# EAGLE design io (EAGLE 7.7.0)
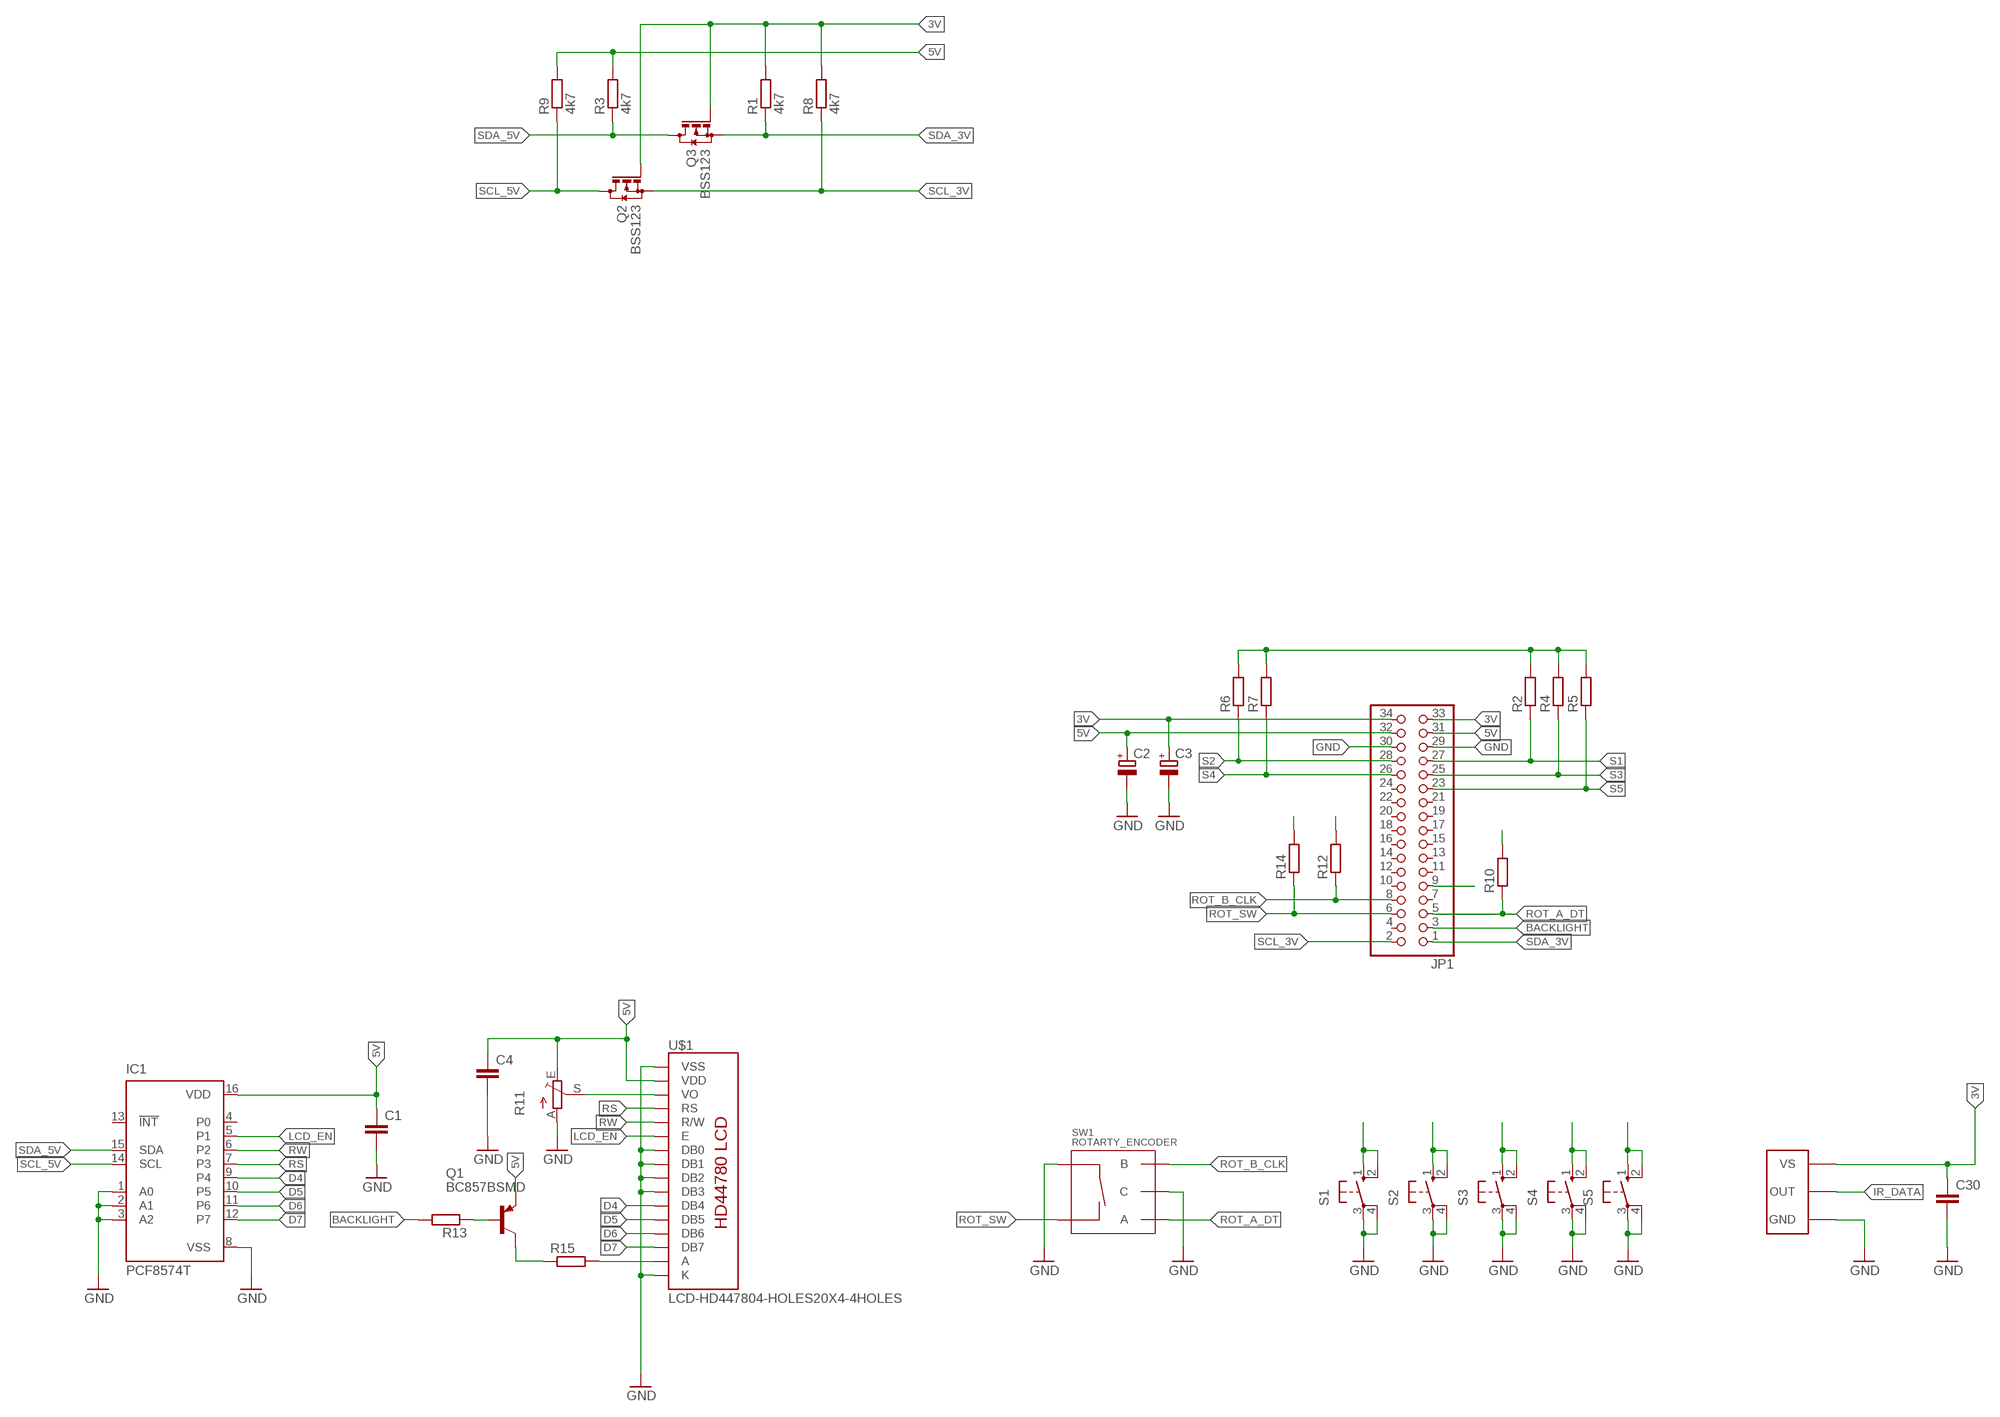
[diagram p0: schematic, sheet 1]

## Parts
C1  C-EUC0603  [C0603]
C2  CPOL-EUSMCD  [SMC_D]
C3  CPOL-EUSMCB  [SMC_B]
C4  C-EUC1206  [C1206]
C30  C-EUC1206  [C1206]
IC1  PCF8574T  [SO16W]
JP1  PINHD-2X17_2.54-SMD  [2X17SMD]
Q1  BC857BSMD  [SOT23-BEC]
Q2  BSS123  [SOT23]
Q3  BSS123  [SOT23]
R1  4k7  R-EU_R0603  [R0603]
R2  R-EU_0204/7  [0204/7]
R3  4k7  R-EU_R0603  [R0603]
R4  R-EU_0204/7  [0204/7]
R5  R-EU_0204/7  [0204/7]
R6  R-EU_0204/7  [0204/7]
R7  R-EU_0204/7  [0204/7]
R8  4k7  R-EU_R0603  [R0603]
R9  4k7  R-EU_R0603  [R0603]
R10  R-EU_0204/7  [0204/7]
R11  TRIM_EU-B25U  [B25U]
R12  R-EU_0204/7  [0204/7]
R13  R-EU_0204/7  [0204/7]
R14  R-EU_0204/7  [0204/7]
R15  R-EU_R0603  [R0603]
S1  40-XX  [B3F-40XX]
S2  40-XX  [B3F-40XX]
S3  40-XX  [B3F-40XX]
S4  40-XX  [B3F-40XX]
S5  40-XX  [B3F-40XX]
SW1  ROTARTY_ENCODER  [ROTARY_ENC_PLAIN]
U$1  LCD-HD447804-HOLES20X4-4HOLES  [LCD-20X4-4HOLES]
U$5  TSOP312XVERTICAL  [TSOP312X_VERT]

## Nets
3V: C3.+ C30.1 JP1.33 JP1.34 Q2.1(G) Q3.1(G) R1.2 R2.2 R4.2 R5.2 R6.2 R7.2 R8.2 R10.2 R12.2 R14.2 U$5.2(VS)
5V: C1.1 C2.+ C4.1 IC1.16(VDD) JP1.31 JP1.32 Q1.E R3.2 R9.2 R11.E U$1.P$2(VDD)
BACKLIGHT: JP1.3 R13.2
D4: IC1.9(P4) U$1.P$11(DB4)
D5: IC1.10(P5) U$1.P$12(DB5)
D6: IC1.11(P6) U$1.P$13(DB6)
D7: IC1.12(P7) U$1.P$14(DB7)
GND: C1.2 C2.- C3.- C4.2 C30.2 IC1.1(A0) IC1.2(A1) IC1.3(A2) IC1.8(VSS) JP1.29 JP1.30 R11.A S1.3(P) S1.4(P1) S2.3(P) S2.4(P1) S3.3(P) S3.4(P1) S4.3(P) S4.4(P1) S5.3(P) S5.4(P1) SW1.C SW1.SW+ U$1.P$1(VSS) U$1.P$7(DB0) U$1.P$8(DB1) U$1.P$9(DB2) U$1.P$10(DB3) U$1.P$16(K) U$5.1(GND)
IR_DATA: JP1.9 U$5.3(OUT)
LCD_EN: IC1.5(P1) U$1.P$6(E)
N$1: Q1.C R15.1
N$3: R15.2 U$1.P$15(A)
N$6: Q1.B R13.1
N$14: R11.S U$1.P$3(VO)
ROT_A_DT: JP1.5 R10.1 SW1.A
ROT_B_CLK: JP1.8 R12.1 SW1.B
ROT_SW: JP1.6 R14.1 SW1.SW-
RS: IC1.7(P3) U$1.P$4(RS)
RW: IC1.6(P2) U$1.P$5(R/W)
S1: JP1.27 R2.1 S1.1(S) S1.2(S1)
S2: JP1.28 R6.1 S2.1(S) S2.2(S1)
S3: JP1.25 R4.1 S3.1(S) S3.2(S1)
S4: JP1.26 R7.1 S4.1(S) S4.2(S1)
S5: JP1.23 R5.1 S5.1(S) S5.2(S1)
SCL_3V: JP1.2 Q2.2(S) R8.1
SCL_5V: IC1.14(SCL) Q2.3(D) R9.1
SDA_3V: JP1.1 Q3.2(S) R1.1
SDA_5V: IC1.15(SDA) Q3.3(D) R3.1
Unconnected: IC1.4(P0) IC1.13(!INT) JP1.4 JP1.7 JP1.10 JP1.11 JP1.12 JP1.13 JP1.14 JP1.15 JP1.16 JP1.17 JP1.18 JP1.19 JP1.20 JP1.21 JP1.22 JP1.24

## Library data of the parts
C1 C4 C30 = rcl:C-EU: CAPACITOR, European symbol
C2 C3 = rcl:CPOL-EU: POLARIZED CAPACITOR, European symbol
IC1 = micro-philips:PCF8574: I2C-Bus Remote 8-bit I/O expander http://www.semiconductors.philips.com/acrobat_download/datasheets/PCF8574_4.pdf; MPN: PCF8574T/3,512; OC_FARNELL: 1201255; OC_NEWARK: 70R6870
JP1 = pinhead-2:PINHD-2X17: PIN HEADER
Q1 = transistor-pnp:BC857*: PNP Transistror
Q2 Q3 = transistor-small-signal:BSS123: N-CHANNEL MOS FET
R1-R10 R12-R15 = rcl:R-EU_: RESISTOR, European symbol
R11 = pot:TRIM_EU-: POTENTIOMETER
S1-S5 = switch-omron:40-XX: OMRON SWITCH; MF: OMRON COMPONENTS USA; MPN: B3F-4000; OC_FARNELL: 176434; OC_NEWARK: 36K3105
SW1 = SparkFun-Electromechanical:ROTARTY_ENCODER: Simple no LED rotary encoder Example: COM-09117
U$1 = HD44780LCD:LCD-HD44780
U$5 = Simplex-ICs:TSOP312X: TSOP ir receiver module for remote control systems

## Board
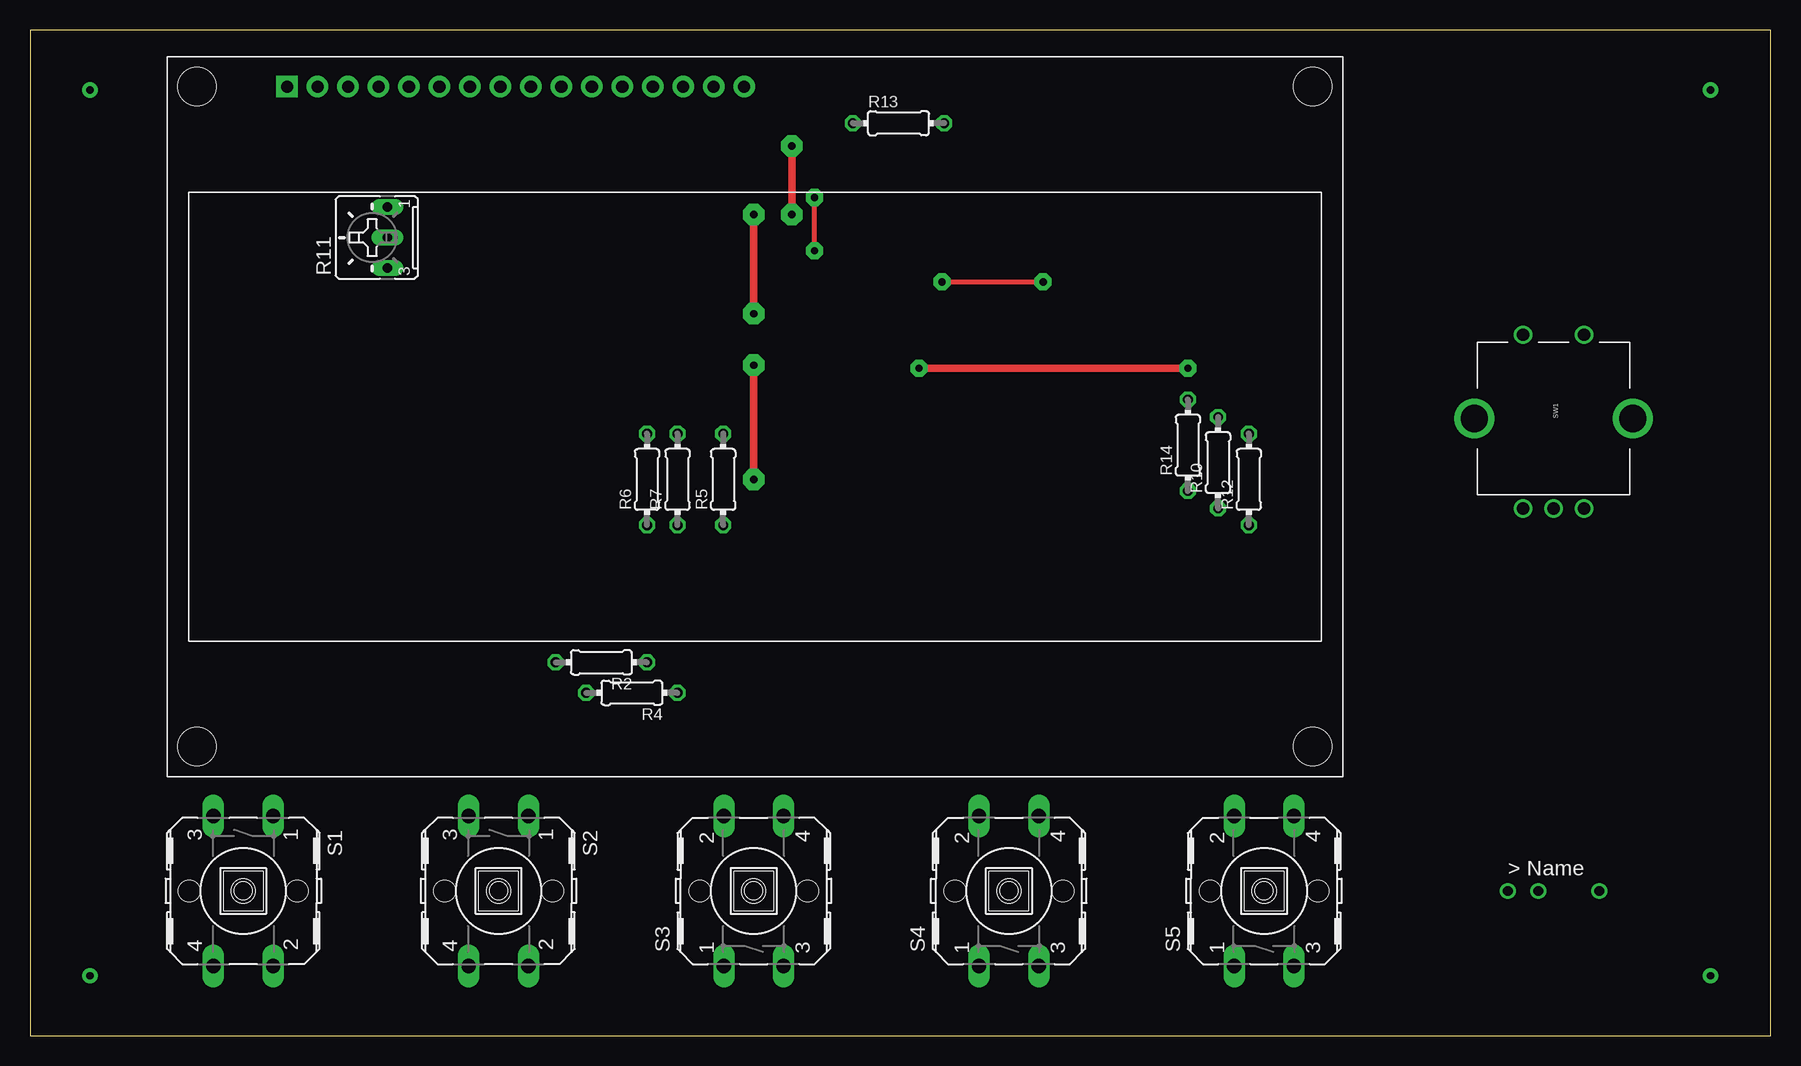
[diagram p1: board, top side]
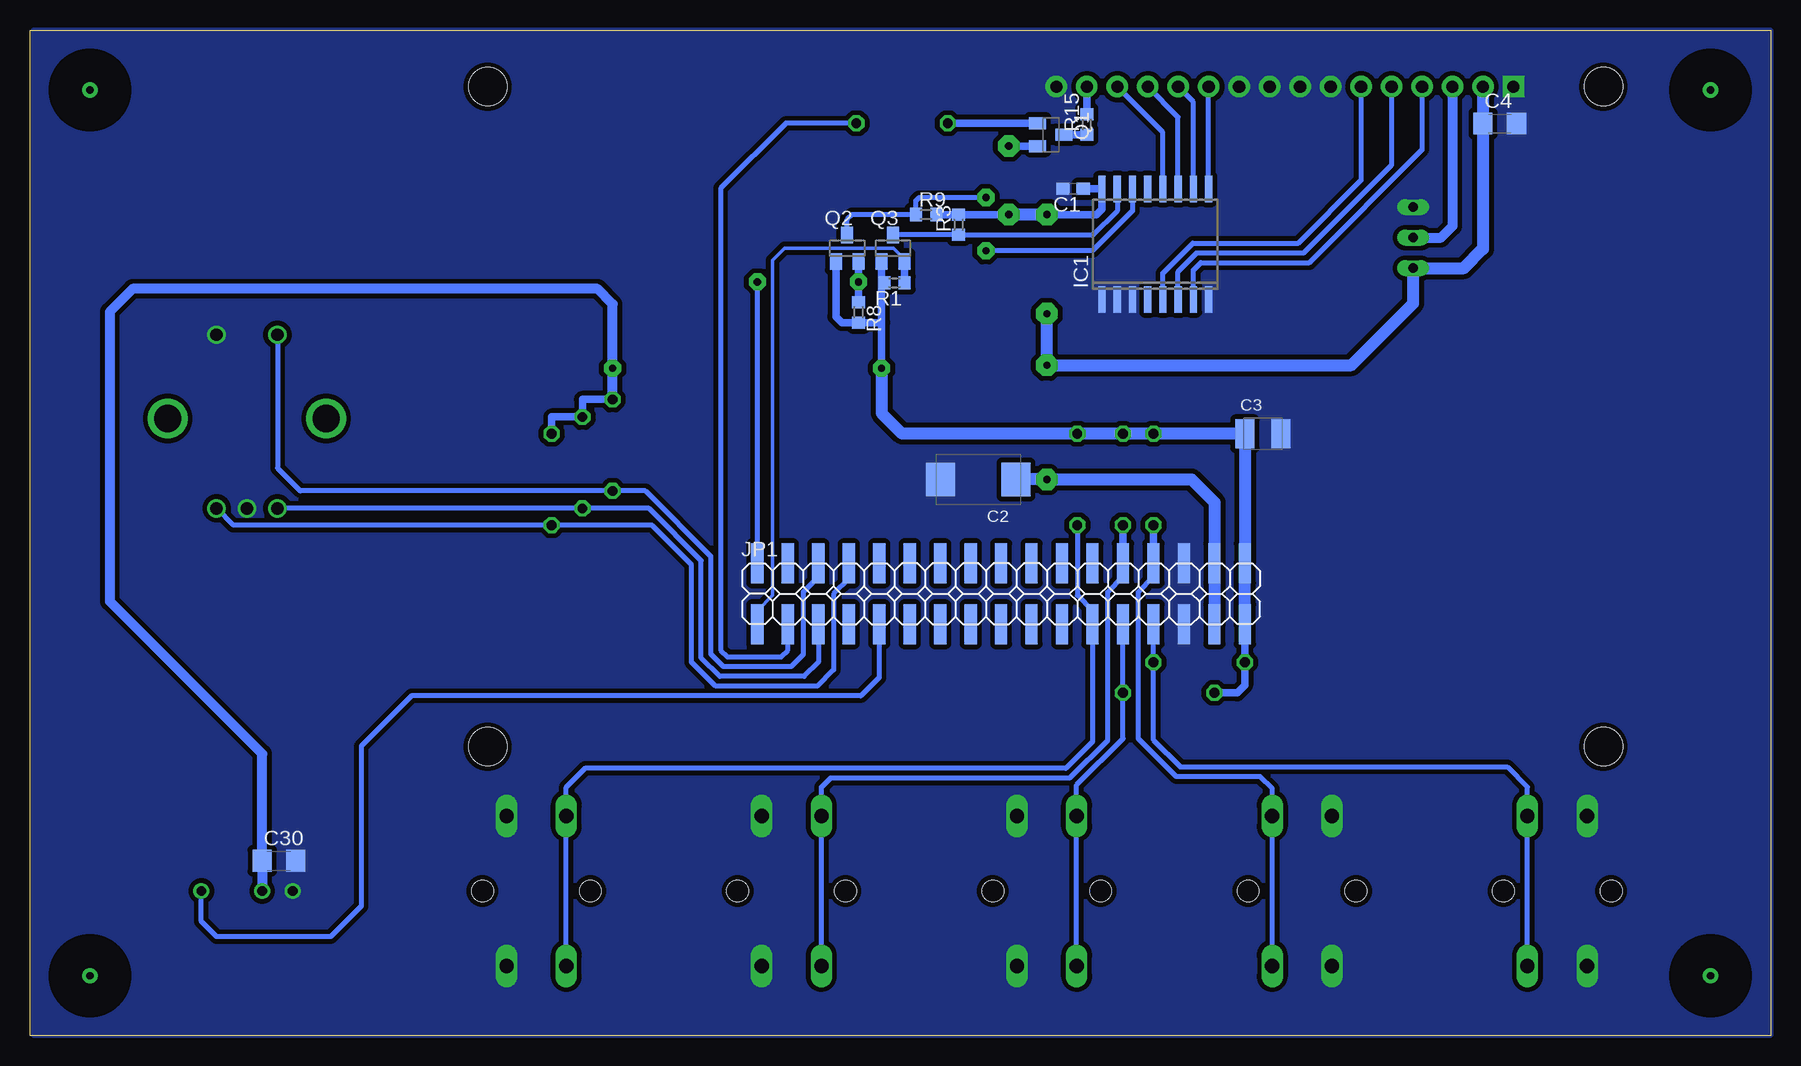
[diagram p2: board, bottom side, seen from below]

Size 145.09 x 83.81 mm. Coordinates in mm from the lower left corner, seen from the top.
Outline: 0,0 145.09,0 145.09,83.81 0,83.81 0,0
Copper layers (1*16): Top 0.035mm / dielectric 1.5mm / Bottom 0.035mm
Design rules "default *": minimum track width 10mil, minimum drill 24mil, track to track 8mil, track to pad 8mil, pad to pad 8mil, via to via 8mil, smd to smd 8mil, copper to edge 0mil, drill to drill 8mil, minimum pad ring 10mil, minimum via ring 8mil, stop-mask expansion 4mil, vias tented up to drill 0mil, thermal gap 10mil
bRestrict: area 2,2 to 8,8; area 137,2 to 143.1,8; area 2,75.8 to 8,81.9; area 137,75.8 to 143.1,81.9

### Footprints (pad centres in the part's own frame; a part is rotated, then mirrored left to right if it is on the bottom)
C0603 = smd 1.1 x 1: 1 -0.85,0; 2 0.85,0
SMC_D = smd 2.4 x 2.8: + -3.15,0; - 3.15,0
SMC_B = smd 1.6 x 2.4: + -1.5,0; - 1.5,0
C1206 = smd 1.6 x 1.8: 1 -1.4,0; 2 1.4,0
SO16W = smd 0.6 x 2.2: 1 -4.445,-4.6; 2 -3.175,-4.6; 3 -1.905,-4.6; 4 -0.635,-4.6; 5 0.635,-4.6; 6 1.905,-4.6; 7 3.175,-4.6; 8 4.445,-4.6; 9 4.445,4.6; 10 3.175,4.6; 11 1.905,4.6; 12 0.635,4.6; 13 -0.635,4.6; 14 -1.905,4.6; 15 -3.175,4.6; 16 -4.445,4.6
2X17SMD = smd 1.016 x 3.302: 1 -1.27,-3.81; 2 -1.27,1.27; 3 1.27,-3.81; 4 1.27,1.27; 5 3.81,-3.81; 6 3.81,1.27; 7 6.35,-3.81; 8 6.35,1.27; 9 8.89,-3.81; 10 8.89,1.27; 11 11.43,-3.81; 12 11.43,1.27; 13 13.97,-3.81; 14 13.97,1.27; 15 16.51,-3.81; 16 16.51,1.27; 17 19.05,-3.81; 18 19.05,1.27; 19 21.59,-3.81; 20 21.59,1.27; 21 24.13,-3.81; 22 24.13,1.27; 23 26.67,-3.81; 24 26.67,1.27; 25 29.21,-3.81; 26 29.21,1.27; 27 31.75,-3.81; 28 31.75,1.27; 29 34.29,-3.81; 30 34.29,1.27; 31 36.83,-3.81; 32 36.83,1.27; 33 39.37,-3.81; 34 39.37,1.27
SOT23-BEC = smd 1 x 1.4: B -0.95,-1.1; C 0,1.1; E 0.95,-1.1
SOT23 = smd 1 x 1.4: 1 -0.95,-1.1; 2 0.95,-1.1; 3 0,1.1
R0603 = smd 1 x 1.1: 1 -0.85,0; 2 0.85,0
0204/7 = drill 0.813 octagon: 1 -3.81,0; 2 3.81,0
B25U = drill 0.813 long: A 2.54,-0.889; E -2.54,-0.889; S 0,-0.889
B3F-40XX = drill 1.194 long: 1 -6.248,2.489; 2 6.248,2.489; 3 -6.248,-2.489; 4 6.248,-2.489 | hole 1.803: 0,-4.496; 0,4.496
ROTARY_ENC_PLAIN = drill 1.016: A 7.493,-2.54; B 7.493,2.54; C 7.493,0; SW+ -6.985,2.54; SW- -6.985,-2.54 | drill 2.286: P$3 0,6.604; P$4 0,-6.604
LCD-20X4-4HOLES = drill 1.016 pad 1.778 square: P$1 10,57.5 | drill 1.016 pad 1.778: P$2 12.54,57.5; P$3 15.08,57.5; P$4 17.62,57.5; P$5 20.16,57.5; P$6 22.7,57.5; P$7 25.24,57.5; P$8 27.78,57.5; P$9 30.32,57.5; P$10 32.86,57.5; P$11 35.4,57.5; P$12 37.94,57.5; P$13 40.48,57.5; P$14 43.02,57.5; P$15 45.56,57.5; P$16 48.1,57.5 | hole 3.2: 2.5,2.5; 2.5,57.5; 95.5,57.5; 95.5,2.5
TSOP312X_VERT = drill 0.8: 1 -3.81,0; 2 -1.27,0; 3 3.81,0

### Placement (x,y rotation side)
C1  58.14,70.56 180 bottom
C2  66.04,46.35 180 bottom
C3  42.32,50.16 0 bottom
C4  22.57,76.02 0 bottom
C30  124.33,14.58 0 bottom
IC1  51.28,65.96 0 bottom
JP1  83.19,38.1 0 bottom
Q1  59.99,75.09 270 bottom
Q2  76.96,65.62 0 bottom
Q3  73.15,65.62 0 bottom
R1  73.03,62.74 180 bottom
R2  47.62,31.11 180 top
R3  67.68,67.58 90 bottom
R4  50.16,28.57 180 top
R5  57.78,46.35 90 top
R6  51.44,46.35 90 top
R7  53.98,46.35 90 top
R8  76.02,60.27 270 bottom
R9  70.38,68.43 0 bottom
R10  99.03,47.75 90 top
R11  28.91,66.52 90 top
R12  101.6,46.35 90 top
R13  72.39,76.04 0 top
R14  96.52,49.21 90 top
R15  56.99,75.94 90 bottom
S1  17.78,12.06 270 top
S2  39.05,12.06 270 top
S3  60.33,12.06 90 top
S4  81.6,12.06 90 top
S5  102.87,12.06 90 top
SW1  127,51.44 270 top
U$1  11.43,21.59 0 top
U$5  127,12.06 0 top

### Tracks (layer width: path | path; a pad name or v marks a point on that pad's centre or on a via)
3V  (via drill 0.6 pad 1.42)
  Top 0.61: v74.1,55.61 v96.52,55.61
  Bottom 0.406: R1.2 73.97,62.74
  Bottom 0.61: 74.1,59.42 74.1,62.87 | 74.1,62.87 Q3.1 | 73.97,62.74 74.1,62.87 | 74.1,59.42 R8.2 77.41,59.42 77.91,59.93 Q2.1 | JP1.33 R2.2 43.81,29.21 44.45,28.57 R4.2 | R14.2 99.03,53.02 R10.2 101.6,51.56 R12.2 | v74.1,55.61 74.1,59.42
  Bottom 0.813: R14.2 v96.52,55.61 96.52,60.96 97.79,62.23 136.53,62.23 138.43,60.33 138.43,36.2 125.73,23.5 C30.1 U$5.2
  Bottom 1.016: JP1.33 JP1.34 C3.+ R6.2 R7.2 R5.2 72.39,50.16 74.1,51.88 v74.1,55.61
5V  (via drill 0.6 pad 1.78)
  Top 0.61: v60.33,46.35 v60.33,55.88 | v60.33,60.17 v60.33,68.43 | v63.5,68.43 v63.5,74.14
  Bottom 0.61: R9.2 R3.2 v63.5,68.43 | v60.33,68.43 56.19,68.43 55.73,68.89 IC1.16 C1.1 | Q1.E 62.86,74.14 v63.5,74.14
  Bottom 1.016: JP1.31 JP1.32 46.35,44.45 48.26,46.35 v60.33,46.35 C2.+ | v60.33,60.17 v60.33,55.88 34.92,55.88 29.79,61.01 R11.E 25.56,63.98 23.97,65.56 C4.1 U$1.P$2 | v60.33,68.43 v63.5,68.43
BACKLIGHT
  Bottom 0.406: JP1.3 81.92,32.13 82.47,31.57 86.94,31.57 87.5,32.13 87.5,70.61 82.08,76.04 R13.2
D4
  Bottom 0.406: IC1.9 U$1.P$11
D5
  Bottom 0.406: IC1.10 48.11,77.83 U$1.P$12
D6
  Bottom 0.406: IC1.11 49.38,76.56 U$1.P$13
D7
  Bottom 0.406: IC1.12 50.65,75.29 U$1.P$14
GND
  pour Bottom (isolate 0.406, no thermals): 0,83.82 0,0 144.78,0 144.78,83.82
IR_DATA
  Bottom 0.406: U$5.3 130.81,9.53 129.54,8.26 120.02,8.26 117.47,10.79 117.47,24.13 113.28,28.32 75.82,28.32 74.3,29.84 JP1.9
LCD_EN
  Bottom 0.406: U$1.P$6 34.13,71.28 39.37,66.04 48.16,66.04 50.65,63.55 IC1.5
N$1
  Bottom 0.61: Q1.C R15.1
N$2  (via drill 0.6 pad 1.27)
  other vias: 5,5
N$3
  Bottom 0.61: R15.2 U$1.P$15
  Bottom 0.813: U$1.P$15
N$5  (via drill 0.6 pad 1.27)
  other vias: 140.09,5
N$6
  Bottom 0.61: Q1.B R13.1
N$8  (via drill 0.6 pad 1.27)
  other vias: 5,78.81
N$10  (via drill 0.6 pad 1.27)
  other vias: 140.09,78.81
N$14
  Bottom 0.813: U$1.P$3 26.51,67.47 27.46,66.52 R11.S
ROT_A_DT
  Bottom 0.406: JP1.5 79.38,31.11 80.54,29.95 87.61,29.95 89.13,31.47 89.13,39.6 93.47,43.94 R10.1 SW1.A
ROT_B_CLK
  Bottom 0.406: JP1.8 76.83,38.1 78.11,36.83 78.11,30.48 79.45,29.13 87.94,29.13 89.94,31.14 89.94,39.24 93.24,42.55 R12.1 128.14,42.55 SW1.B
ROT_SW
  Bottom 0.406: JP1.6 79.38,38.23 80.64,36.96 80.64,31.75 81.64,30.76 87.27,30.76 88.32,31.8 88.32,39.93 93.79,45.4 R14.1 122.56,45.4 124.46,47.31 SW1.SW-
RS
  Bottom 0.406: U$1.P$4 29.05,73.82 38.46,64.41 47.5,64.41 48.11,63.8 IC1.7
RW
  Bottom 0.406: U$1.P$5 31.59,72.55 38.91,65.23 47.83,65.23 49.38,63.68 IC1.6
S1
  Bottom 0.406: S1.2 S1.1 20.27,20.73 21.95,22.4 49.2,22.4 51.44,24.64 R2.1 JP1.27
S2
  Bottom 0.406: JP1.28 51.44,38.23 52.7,36.96 52.7,24.77 49.53,21.59 42.55,21.59 41.54,20.59 S2.1 S2.2
  Bottom 0.61: JP1.28 R6.1
S3
  Bottom 0.406: S3.1 S3.2 57.84,20.9 53.98,24.77 R4.1 JP1.25
S4
  Bottom 0.406: JP1.26 53.98,38.23 55.24,36.96 55.24,24.64 58.42,21.46 78.36,21.46 79.11,20.71 S4.2 S4.1
  Bottom 0.61: JP1.26 R7.1
S5
  Bottom 0.406: S5.1 S5.2 100.38,20.73 98.83,22.28 58.75,22.28 56.52,24.51 JP1.23 56.52,35.43 57.78,36.7 R5.1
SCL_3V  (via drill 0.6 pad 1.42)
  Top 0.406: v76.01,62.81 v84.45,62.81
  Bottom 0.305: Q2.2 76.01,64.71
  Bottom 0.406: JP1.2 v84.45,62.81
  Bottom 0.61: Q2.2 v76.01,62.81 76.02,62.8 R8.1
SCL_5V  (via drill 0.6 pad 1.42)
  Top 0.406: v65.41,65.41 v65.41,69.85
  Bottom 0.406: IC1.14 53.19,68.73 56.52,65.41 v65.41,65.41 | v65.41,69.85 70.97,69.85 71.23,69.58 R9.1 76.56,68.43 76.96,68.02 Q2.3
SDA_3V
  Bottom 0.305: Q3.2 72.2,64.71 73.11,65.62 82.18,65.62 83.19,64.62 83.19,36.7 84.45,35.43 JP1.1
  Bottom 0.61: R1.1 72.2,62.77 Q3.2
SDA_5V
  Bottom 0.406: Q3.3 R3.1 56.46,66.73 54.46,68.73 IC1.15